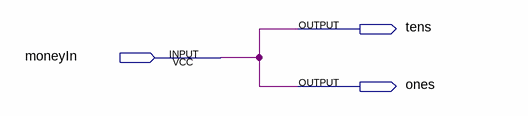
[diagram p0: schematic sheet]
// Quartus schematic coinDecoder.bdf as structural Verilog: 0 symbols, 3 pins
module coinDecoder (
  input  moneyIn,
  output tens,
  output ones
);


  assign ones = moneyIn;
  assign tens = moneyIn;
endmodule
